# Altium schematic sheet AND_operations.SchDoc
size A4; SheetNumber: 4; SheetTotal: 5
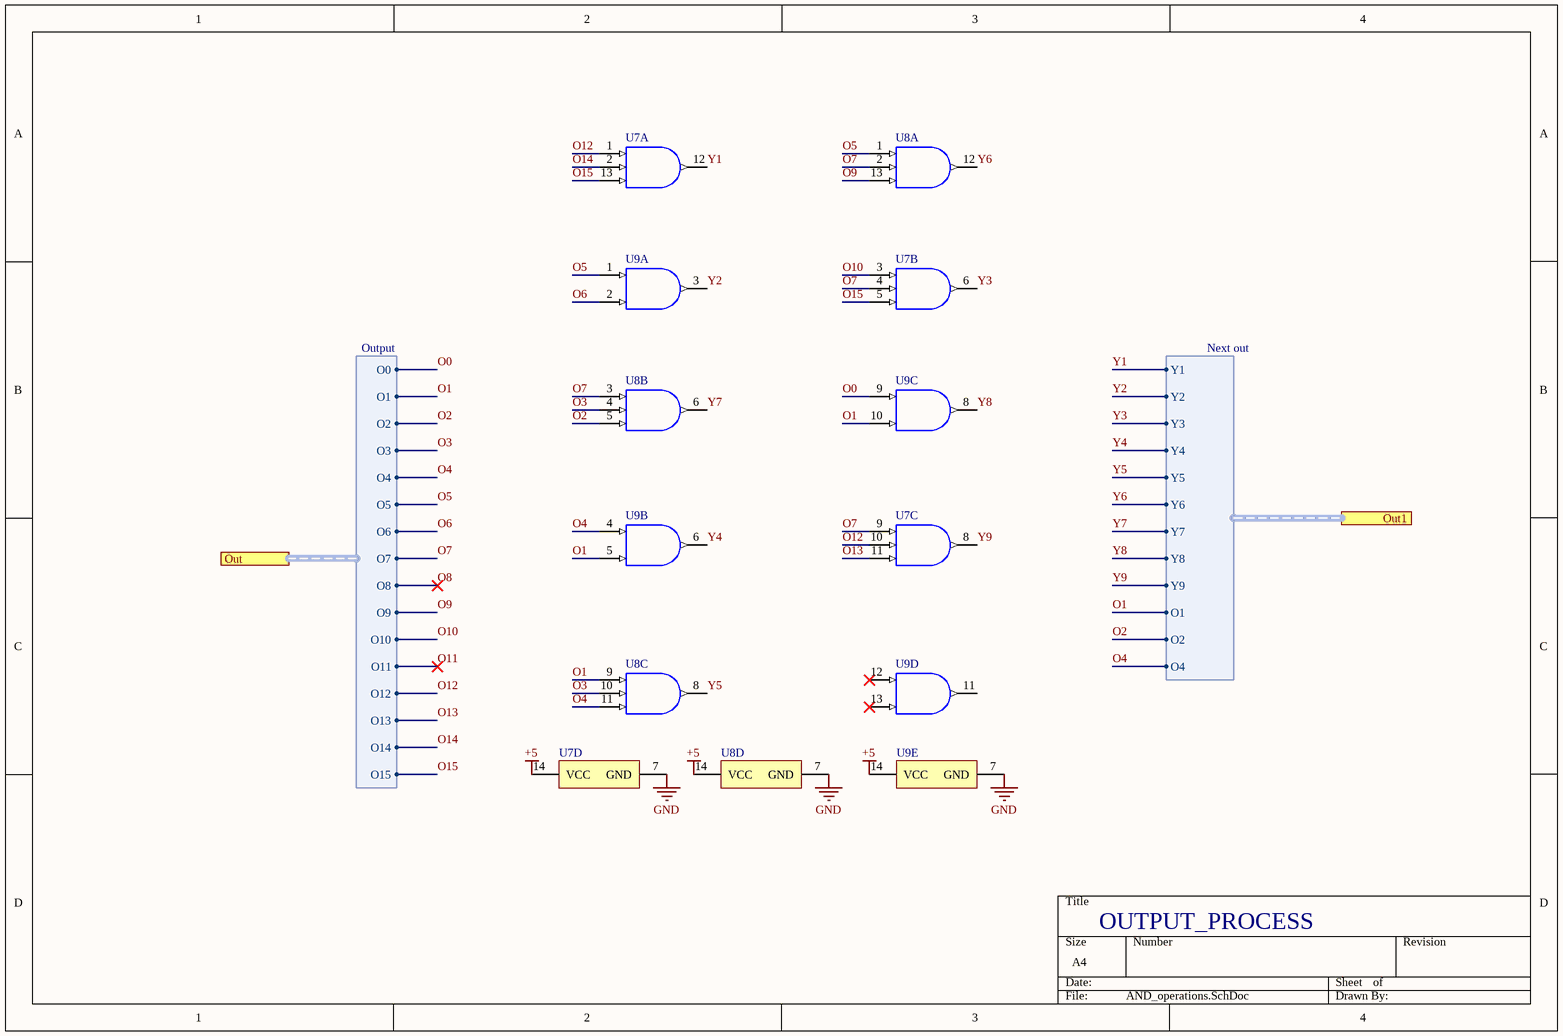
[diagram p0: AND_operations.SchDoc]

## Parts
U7  SN74LS11N  [N0014A]  (value not drawn)  (parts A,B,C,D of 4)
U8  SN74LS11N  [N0014A]  (value not drawn)  (parts A,B,C,D of 4)
U9  SN74S08N  [N0014A]  (value not drawn)  (parts A,B,C,D,E of 5)

## Ports
Out1 (harness Next out, see Final out 2[1B]), Out (harness Output, see encode and decode 2[4B])

## Harnesses
Output: O0, O1, O10, O11, O12, O13, O14, O15, O2, O3, O4, O5, O6, O7, O8, O9
Next out: Y1, Y2, Y3, Y4, Y5, Y6, Y7, Y8, Y9, O1, O2, O4

## Nets
+5: U7.14(VCC) U8.14(VCC) U9.14(VCC)
GND: U7.7(GND) U8.7(GND) U9.7(GND)
O0: U9.9(3A) ; port Out.O0
O1: U8.9(3A) U9.5(2B) U9.10(3B) ; port Out.O1, port Out1.O1
O2: U8.5(2C) ; port Out.O2, port Out1.O2
O3: U8.4(2B) U8.10(3B) ; port Out.O3
O4: U8.11(3C) U9.4(2A) ; port Out.O4, port Out1.O4
O5: U8.1(1A) U9.1(1A) ; port Out.O5
O6: U9.2(1B) ; port Out.O6
O7: U7.4(2B) U7.9(3A) U8.2(1B) U8.3(2A) ; port Out.O7
O8: port Out.O8
O9: U8.13(1C) ; port Out.O9
O10: U7.3(2A) ; port Out.O10
O11: port Out.O11
O12: U7.1(1A) U7.10(3B) ; port Out.O12
O13: U7.11(3C) ; port Out.O13
O14: U7.2(1B) ; port Out.O14
O15: U7.5(2C) U7.13(1C) ; port Out.O15
Y1: U7.12(1Y) ; port Out1.Y1
Y2: U9.3(1Y) ; port Out1.Y2
Y3: U7.6(2Y) ; port Out1.Y3
Y4: U9.6(2Y) ; port Out1.Y4
Y5: U8.8(3Y) ; port Out1.Y5
Y6: U8.12(1Y) ; port Out1.Y6
Y7: U8.6(2Y) ; port Out1.Y7
Y8: U9.8(3Y) ; port Out1.Y8
Y9: U7.8(3Y) ; port Out1.Y9

Not connected (* = marked no-connect by the designer): U9 11(4Y) 12(4A)* 13(4B)*

## Notes on the sheet
- OUTPUT_PROCESS

## Library data of the parts
U7 U8 = CMP-0777-00254-3: Triple 3-input positive-AND gates, N0014A, TUBE; Manufacturer: Texas Instruments; Output Type: TTL; VCC(Min)(V): 4.75; Technology Family: LS; Bits(#): 3; Voltage(Nom)(V): 5; ICC @ Nom Voltage(Max)(mA): 0.0036; Rating: Catalog; VCC(Max)(V): 5.25; tpd @ Nom Voltage(Max)(ns): 15; Output Drive (IOL/IOH)(Max)(mA): 0/8; F @ Nom Voltage(Max)(Mhz): 35; Schmitt Trigger: No; Input Type: TTL; DatasheetVersion: SDLS131; PackageReference: N0014A; Operating Temperature Range(C): 0 to 70; Generic Part Number: SN74LS11
U9 = CMP-0777-00282-3: Quad 2-input positive-AND gates, N0014A, TUBE; Manufacturer: Texas Instruments; Output Drive (IOL/IOH)(Max)(mA): -24/24; Rating: Catalog; VCC(Min)(V): 4.75; Bits(#): 4; Input Type: TTL; Schmitt Trigger: No; tpd @ Nom Voltage(Max)(ns): 7.5; Technology Family: S; Voltage(Nom)(V): 5; VCC(Max)(V): 5.25; F @ Nom Voltage(Max)(Mhz): 50; ICC @ Nom Voltage(Max)(mA): 0.032; PackageReference: N0014A; DatasheetVersion: SDLS033; Operating Temperature Range(C): 0 to 70; Output Type: TTL; Generic Part Number: SN74S08